# Altium schematic sheet MB1-SD_CARD.SchDoc: uSD card
size A; Author: Nguyen Van Hien; DrawnBy: MBoard team; DocumentNumber: 6; Revision: 1.1; SheetNumber: 6; SheetTotal: 7; DocumentName: SD_CARD
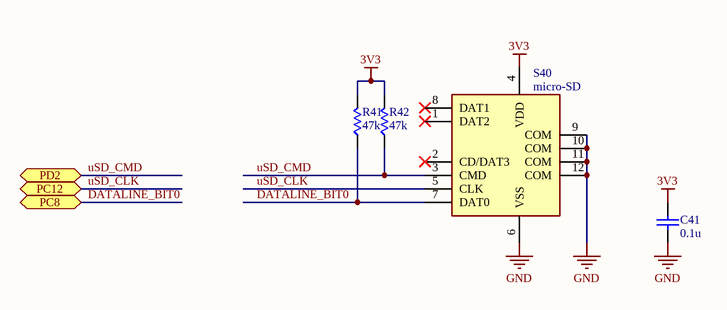
[diagram p0: MB1-SD_CARD.SchDoc]

## Parts
C41  value 0.1u  [SM_0805_LD]  (hidden comment: CAP_Ceramic)
R41  value 47k  [SM_0805_LD]
R42  value 47k  [SM_0805_LD]
S40  micro-SD  [micro-SD]

## Ports
PC8 (bidir), PC12 (bidir), PD2 (bidir)

## Nets
3V3: C41.2 R41.2 R42.2 S40.4(VDD)
GND: C41.1 S40.6(VSS) S40.9(COM) S40.10(COM) S40.11(COM) S40.12(COM)
DATALINE_BIT0: R41.1 S40.7(DAT0) ; port PC8
uSD_CLK: S40.5(CLK) ; port PC12
uSD_CMD: R42.1 S40.3(CMD) ; port PD2

Not connected (* = marked no-connect by the designer): S40 1(DAT2)* 2(CD/DAT3)* 8(DAT1)*

## Library data of the parts
C41 = C_Ceramic: Non-polarity ceramic capacitor; Published: 8-Jun-2000; LatestRevisionDate: 17-Jul-2002; LatestRevisionNote: Re-released for DXP Platform.; PackageReference: RAD-0.3; Publisher: Altium Limited; PackageDescription: Radial Cap, Thru-Hole; 2 Leads; 0.3 in Pin Spacing
R41 R42 = R: Resistor; Published: 8-Jun-2000; LatestRevisionDate: 29-May-2009; LatestRevisionNote: IPC-7351 Footprint Added.; PackageReference: J1-0603; Publisher: Altium Limited; PackageDescription: Chip Resistor